# Altium schematic sheet 心率血氧检测仪.SchDoc: 心率血氧检测仪
size A4; DrawnBy: 李佳; Revision: V0.0
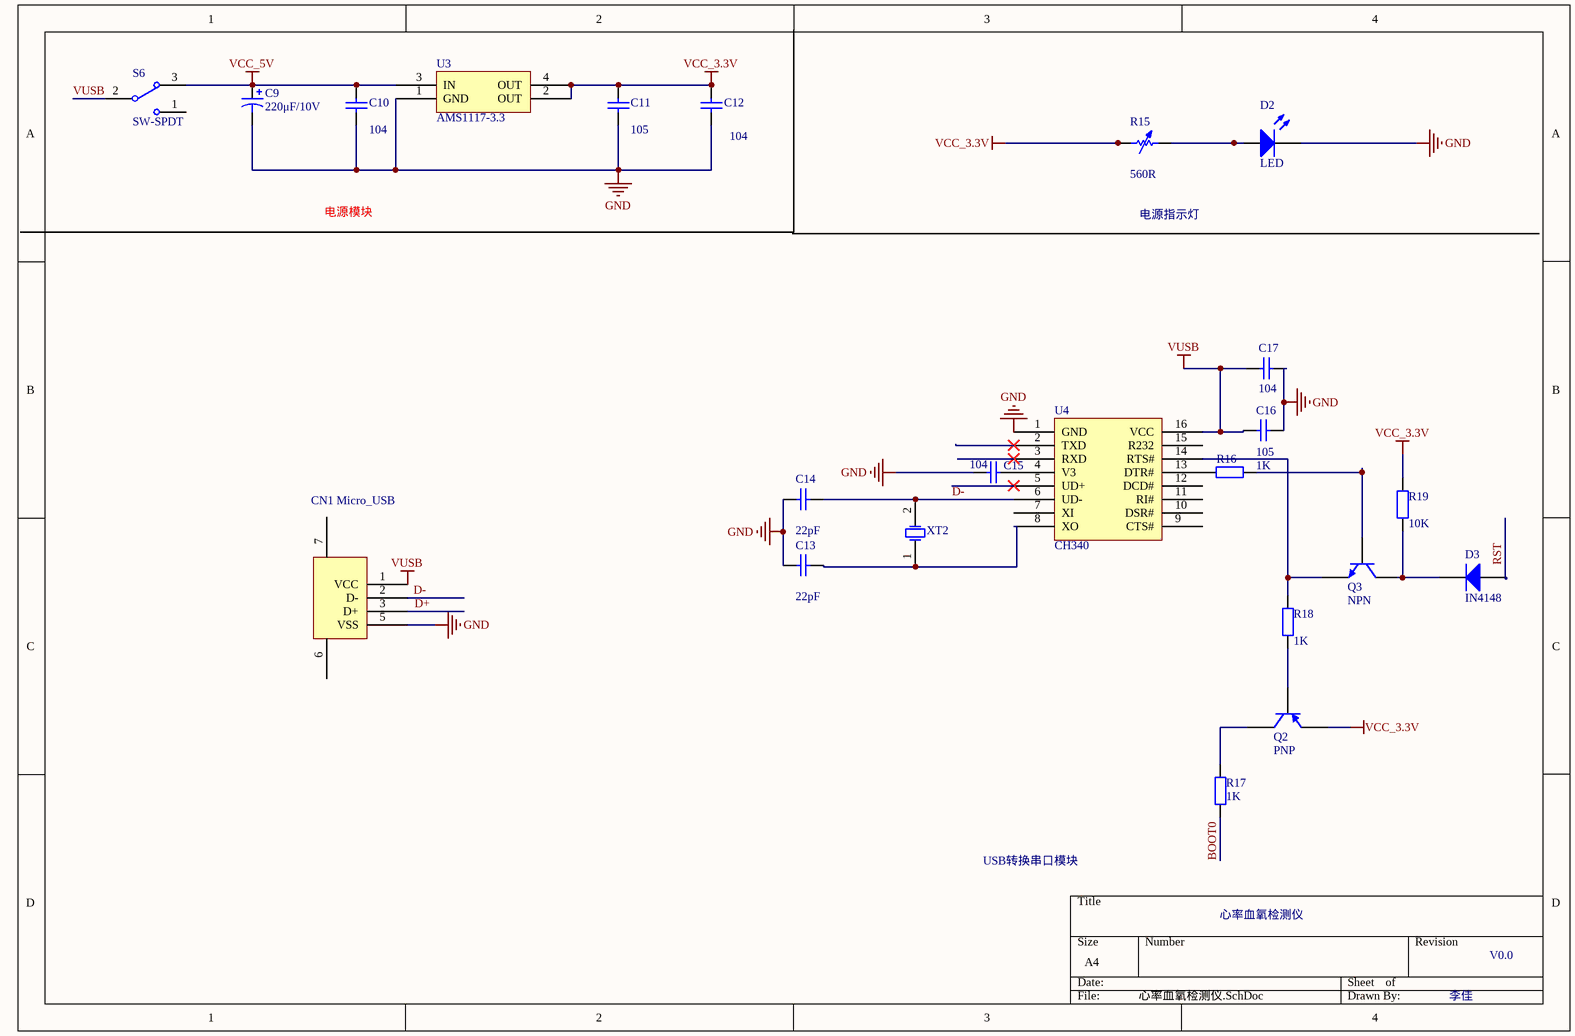
[diagram p0: 心率血氧检测仪.SchDoc]

## Parts
*2  CN1 Micro_USB  [SOT-223]
C9  value 220μF/10V  [CAP6.5X6.5]  (hidden comment: Cap Pol1)
C10  value 104  [0805C]  (hidden comment: Cap)
C11  value 105  [0805C]  (hidden comment: Cap)
C12  value 104  [0805C]  (hidden comment: Cap)
C13  value 22pF  [0805C]  (hidden comment: Cap)
C14  value 22pF  [0805C]  (hidden comment: Cap)
C15  value 104  [0805C]  (hidden comment: Cap)
C16  value 105  [0805C]
C17  value 104  [0805C]  (hidden comment: Cap)
D2  LED  [LED_0805]
D3  IN4148  [DO-213AA]
Q2  PNP  [SOT-23]
Q3  NPN  [SOT-23]
R15  value 560R  [0805]  (hidden comment: Res Adj1)
R16  value 1K  [0805]  (hidden comment: Res2)
R17  value 1K  [0805]  (hidden comment: Res2)
R18  value 1K  [0805]  (hidden comment: Res2)
R19  value 10K  [0805]  (hidden comment: Res2)
S6  SW-SPDT  [BTN8*8]
U3  AMS1117-3.3  [SOT-223]
U4  CH340  [SOP16]
XT2  XTAL  [HC-49S]  (value not drawn)

## Nets
GND: *2.5(VSS) C9.2 C10.2 C11.2 C12.2 C13.1 C14.1 C15.1 C16.2 C17.2 D2.2(K) U3.1(GND) U4.1(GND)
VCC_3.3V: C11.1 C12.1 Q2.1(E) R15.1 R19.2 U3.2(OUT) U3.4(OUT)
VCC_5V: C9.1 C10.1 S6.3 U3.3(IN)
VUSB: *2.1(VCC) C16.1 C17.1 S6.2 U4.16(VCC)
BOOT0: R17.1
D+: *2.3(D+)
D-: *2.2(D-) C14.2 U4.6(UD-) XT2.2(OSC2)
RST: D3.1(A)
NetC13_2: C13.2 U4.8(XO) XT2.1(OSC1)
NetC15_2: C15.2 U4.4(V3)
NetD2_1: D2.1(A) R15.2
NetD3_2: D3.2(K) Q3.3(C) R19.1
NetQ2_2: Q2.2(B) R18.1
NetQ2_3: Q2.3(C) R17.2
NetQ3_1: Q3.1(E) R18.2 U4.14(RTS#)
NetQ3_2: Q3.2(B) R16.2
NetR16_1: R16.1 U4.13(DTR#)

Not connected (* = marked no-connect by the designer): *2 6(7) 7(6); S6 1; U4 2(TXD)* 3(RXD)* 5(UD+)* 7(XI) 9(CTS#) 10(DSR#) 11(RI#) 12(DCD#) 15(R232)

## Notes on the sheet
- 电源模块
- 电源指示灯
- USB转换串口模块

## Library data of the parts
C9 = Cap Pol1: Polarized Capacitor (Radial); Published: 8-Jun-2000; LatestRevisionDate: 17-Jul-2002; LatestRevisionNote: Re-released for DXP Platform.; PackageReference: RB7.6-15; Publisher: Altium Limited; PackageDescription: Polarized Capacitor (Radial); 2 Leads
C10-C17 = Cap: Capacitor; Published: 8-Jun-2000; LatestRevisionDate: 17-Jul-2002; LatestRevisionNote: Re-released for DXP Platform.; PackageReference: RAD-0.3; Publisher: Altium Limited; PackageDescription: Radial Cap, Thru-Hole; 2 Leads; 0.3 in Pin Spacing
D2 = LED0: Typical INFRARED GaAs LED; Published: 8-Jun-2000; LatestRevisionDate: 08-Jul-2005; LatestRevisionNote: Mech Layer 1 removed.; PackageReference: LED-0; Publisher: Altium Limited; PackageDescription: LED; 2 Leads
D3 = Diode: Default Diode; Published: 8-Jun-2000; LatestRevisionDate: 17-Jul-2002; LatestRevisionNote: Re-released for DXP Platform.; PackageVersion: Sep-1996; PackageReference: SMC; Publisher: Altium Limited; PackageDescription: DO-214-AB/SMC; 2 C-Bend Leads; Body 7.9 x 5.9 mm, inc. leads (LxW); Code_JEDEC: DO-214-AB
Q2 = 2N3906: PNP General Purpose Amplifier; Published: 8-Jun-2000; LatestRevisionDate: 15-Jan-2003; LatestRevisionNote: PCB Footprint 'BCY-W3/D4.7' replaced; DatasheetVersion: 1997; PackageVersion: Sep-1998; PackageReference: TO-92A; Publisher: Altium Limited; PackageDescription: TO, Flat Index; 3 In-Line, Axial Leads; Body Dia. 4.5mm; Leads 0.51 x 0.48 mm (max); ComponentLink1Description: Manufacturer Link; ComponentLink1URL: http://www.fairchildsemi.com/; ComponentLink2Description: Datasheet; ComponentLink2URL: http://www.fairchildsemi.com/ds/2N%2F2N3906.pdf
Q3 = 2N3904: NPN General Purpose Amplifier; Published: 8-Jun-2000; LatestRevisionDate: 15-Jan-2003; LatestRevisionNote: PCB Footprint 'BCY-W3/D4.7' replaced; DatasheetVersion: 1997; PackageVersion: Sep-1998; PackageReference: TO-92A; Publisher: Altium Limited; PackageDescription: TO, Flat Index; 3 In-Line, Axial Leads; Body Dia. 4.5mm; Leads 0.51 x 0.48 mm (max); ComponentLink1Description: Manufacturer Link; ComponentLink1URL: http://www.fairchildsemi.com/; ComponentLink2Description: Datasheet; ComponentLink2URL: http://www.fairchildsemi.com/ds/2N%2F2N3904.pdf
R15 = Res Adj1: Variable Resistor; Set Position: 0.5; Published: 8-Jun-2000; LatestRevisionDate: 17-Jul-2002; LatestRevisionNote: Re-released for DXP Platform.; PackageReference: AXIAL-0.7; Publisher: Altium Limited; PackageDescription: Axial Device, Thru-Hole; 2 Leads; 0.7 in Pin Spacing
R16-R19 = Res2: Resistor; Published: 8-Jun-2000; LatestRevisionDate: 17-Jul-2002; LatestRevisionNote: Re-released for DXP Platform.; PackageReference: AXIAL-0.4; Publisher: Altium Limited; PackageDescription: Axial Device, Thru-Hole; 2 Leads; 0.4 in Pin Spacing
S6 = SW-SPDT: SPDT Subminiature Toggle Switch, Right Angle Mounting, Vertical Actuation; Published: 24-Mar-1999; LatestRevisionDate: 17-Dec-2003; LatestRevisionNote: Schematic revised, PCB Footprint replaced.; DatasheetVersion: 05-Dec-2000; PackageReference: TL36WW15050; Publisher: Altium Limited; PackageDescription: Switch; 4 Leads; ComponentLink1Description: Manufacturer Link; ComponentLink1URL: http://www.apem.com
XT2 = XTAL: Crystal Oscillator; Value: 12MHZ; Published: 8-Jun-2000; LatestRevisionDate: 17-Jul-2002; LatestRevisionNote: Re-released for DXP Platform.; PackageReference: R38; Publisher: Altium Limited; PackageDescription: Crystal, Thru-Hole; 2 Leads; Body 3.1 x 8.2 mm (Dia.xH)